# Altium project Assignment2.PrjPcb (part 2 of 2)

## Sheet IMU_LSM6DSOTR.SchDoc: IMU LSM6DSOTR
size 431 x 279 mm; Date: 02/15/2021; DrawnBy: Team KOIN; Organization: University of Pennsylvania; DocumentNumber: 8; Revision: 2; SheetNumber: 3; SheetTotal: 8
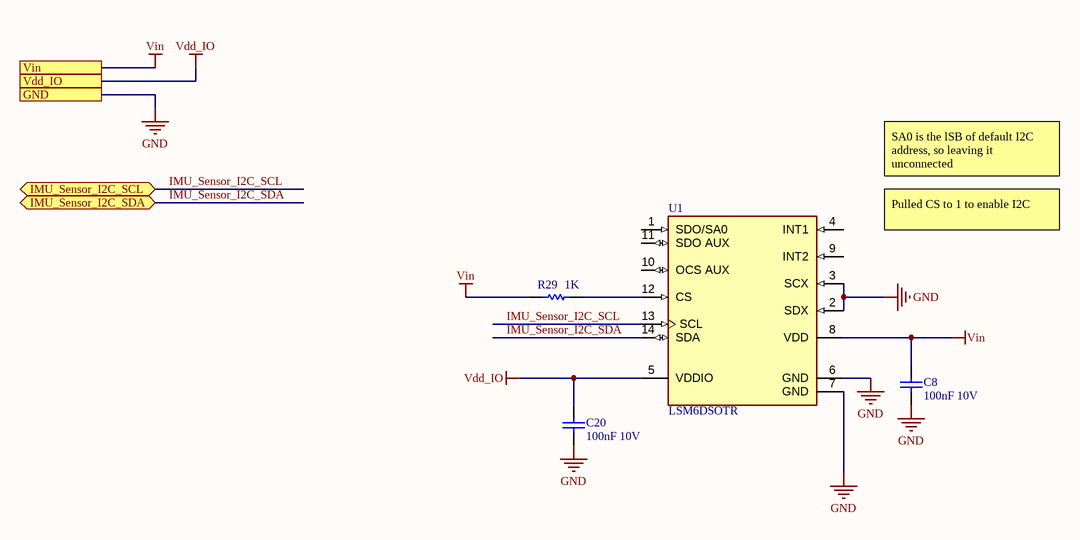
[diagram p6: IMU_LSM6DSOTR.SchDoc]

### Parts
C8  100nF 10V  [CAPC0402(1005)60_L]
C20  100nF 10V  [CAPC0402(1005)60_L]
R29  1K  [RESC0603(1608)_M]
U1  LSM6DSOTR  [FP-LGA-14L-DM00249496-MFG]

### Ports
GND, IMU_Sensor_I2C_SCL (bidir), IMU_Sensor_I2C_SDA (bidir), Vdd_IO, Vin

### Nets
GND: C8.2 C20.2 U1.2(SDX) U1.3(SCX) U1.6(GND) U1.7(GND) ; port GND
Vdd_IO: C8.1 C20.1 R29.1 U1.5(VDDIO) U1.8(VDD) ; port Vin, port Vdd_IO  [also labelled Vin]  [project net 3V3]
IMU_Sensor_I2C_SCL: U1.13(SCL) ; port IMU_Sensor_I2C_SCL  [project net IMU_I2C_SCL]
IMU_Sensor_I2C_SDA: U1.14(SDA) ; port IMU_Sensor_I2C_SDA  [project net IMU_I2C_SDA]
NetR29_2: R29.2 U1.12(CS)

Not connected (* = marked no-connect by the designer): U1 1(SDO/SA0) 4(INT1) 9(INT2) 10(OCS_AUX) 11(SDO_AUX)

### Notes on the sheet
- SA0 is the lSB of default I2C address, so leaving it unconnected
- Pulled CS to 1 to enable I2C
- DWG. NO.
- REV.
- SHT.
- THIS DOCUMENT AND THE DATA DISCLOSED HEREIN OR HEREWITH IS THE PROPERTY OF ALTIUM LIMITED AND MAY BE FREELY DISTRIBUTED IN WHOLE. NO RIGHTS ARE RESERVED OR EXPRESS OR IMPLIED WARANTEE GIVEN.
- REVISION
- DESCRIPTION
- DATE
- APPROVED
- ENG:
- APPROVALS
- PROJECT
- DSN:
- CHK:
- REFERENCE DOCUMENTS
- PROJECT REVISION:
- TITLE
- DOCUMENT REVISION:
- DESIGN ITEM:
- BOM:
- FAB DWG:
- PCB DWG:
- ASSY DWG:
- SCALE:
- SIZE
- B
- CAGE CODE
- FILE NAME
- DWG NO.
- SHEET
- OF
- REV

### Library data of the parts
C8 C20 = CMP-1034-02064-1: CAP 100nF 10V ±5% 0402 (1005 Metric) Thickness 0.6mm SMD; Tolerance: Â±5%; Case-EIA: 0402; Case-Metric: 1005; Max Thickness: 0.6 mm; Value: 100nF; Rated Voltage: 10 V; Technology: SMT
R29 = CMP-1012-00510-1: 1K 0.1W 1% 0603 (1608 Metric)  SMD; Case-Metric: 1608; Case-EIA: 0603; Value: 1000.00 Ohm; Technology: SMT; Tolerance: 1 %; Power: 0.1 W
U1 = CMP-12177-000012-1: CONSUMER MEMS; Manufacturer: STMicroelectronics; Gyro Range: 125/250/500/1000/2000°/s; Max Supply Voltage: 3.6V; Sensor Output: I2C,SPI; Operating Supply Current: 0.55mA; Accel Range: 2/4/8/16g; Min Supply Voltage: 1.62V; Sensor Type: Temperature,Accelerometer,Gyroscope; Height: 0.86mm; Automotive: No; Device Class L3: Inertial Measurement Units (IMUs); Device Class L1: Sensors; ComponentLink2Description: Datasheet; Device Class L2: Motion Sensors; Temperature: -40°C to +85°C; Package: LGA-14L-DM00249496; Octopart: https://octopart.com/lsm6dsotr-stmicroelectronics-81706672; Temperature Range Low: -40°C; Digikey Description: CONSUMER MEMS; ComponentLink2URL: https://www.st.com/resource/en/datasheet/lsm6dso.pdf; Manufacturer Part Number: LSM6DSOTR; Mouser Description: iNEMO inertial module: "always-on" integrated 3D accelerometer and 3D gyroscope; Footprint Url: https://www.st.com/content/ccc/resource/technical/document/technical_note/73/17/9c/16/dd/96/4a/01/CD00134799.pdf/files/CD00134799.pdf/jcr:content/translations/en.CD00134799.pdf; Lead Free: Yes; RoHS: TRUE; Category: IC; Temperature Range High: +85°C

## Sheet Buzzer.SchDoc
size 431 x 279 mm; SheetNumber: 8; SheetTotal: 8
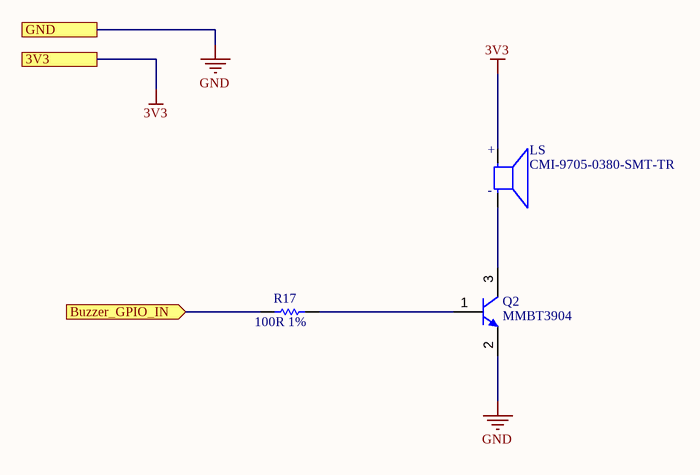
[diagram p7: Buzzer.SchDoc]

### Parts
LS  CMI-9705-0380-SMT-TR  [CUI_CMI-9705-0380-SMT-TR]
Q2  MMBT3904  [INF-SOT23_L]
R17  100R 1%  [RESC0603(1608)_N]

### Ports
3V3, Buzzer_GPIO_IN (in), GND

### Nets
3V3: LS.P ; port 3V3
GND: Q2.2(E) ; port GND
Buzzer_GPIO: R17.1 ; port Buzzer_GPIO_IN
NetLS_N: LS.N Q2.3(C)
NetQ2_1: Q2.1(B) R17.2

### Notes on the sheet
- DWG. NO.
- REV.
- SHT.
- THIS DOCUMENT AND THE DATA DISCLOSED HEREIN OR HEREWITH IS THE PROPERTY OF ALTIUM LIMITED AND MAY BE FREELY DISTRIBUTED IN WHOLE. NO RIGHTS ARE RESERVED OR EXPRESS OR IMPLIED WARANTEE GIVEN.
- REVISION
- DESCRIPTION
- DATE
- APPROVED
- ENG:
- APPROVALS
- PROJECT
- DSN:
- CHK:
- REFERENCE DOCUMENTS
- PROJECT REVISION:
- TITLE
- DOCUMENT REVISION:
- DESIGN ITEM:
- BOM:
- FAB DWG:
- PCB DWG:
- ASSY DWG:
- SCALE:
- SIZE
- B
- CAGE CODE
- FILE NAME
- DWG NO.
- SHEET
- OF
- REV
- (in symbol CMI-9705-0380-SMT-TR) +; -

### Library data of the parts
LS = CMI-9705-0380-SMT-TR: 9.7 mm, 3 Vdc, 80 dB, Surface Mount, Driving Circuit, Magnetic Audio Indicator Buzzer; MF: CUI Devices; Value: *; CUI_purchase_URL: https://www.cuidevices.com/product/audio/buzzers/audio-indicators/cmi-9705-0380-smt-tr?utm_source=snapeda.com&utm_medium=referral&utm_campaign=snapedaBOM; Price: None; Package: CUI Inc.; SnapEDA_Link: https://www.snapeda.com/parts/CMI-9705-0380-SMT-TR/CUI%20Devices/view-part/3662541/?ref=snap; Availability: Unavailable; MP: CMI-9705-0380-SMT-TR
Q2 = CMP-1178-00008-1: NPN Silicon Switching Transistor, 40 V VCEO, 200 mA IC, SOT23, Reel, Green; Manufacturer: Infineon; IC (max): 200 mA; VCBO (max): 60 V; VCE (max): 1 V; Green: TRUE; ICBO (max): 50 nA; IC: 10 mA; VCEO (max): 40 V; VEBO (max): 6 V; ComponentLink3Description: Package Specification; ComponentLink2Description: Datasheet; PackageDescription: 3-Pin Small Outline Transistor Package, 1.3 x 2.9 mm Body, 0.95 mm Pitch; Packing: Reel; ComponentLink1Description: Manufacturer URL; Polarity: NPN; ComponentLink3URL: http://www.infineon.com/dgdl/SOT23-Package_Overview.pdf?folderId=db3a30431936bc4b0119532290053c66&fileId=db3a30431936bc4b0119533468123c85; PackageReference: SOT23; Mounting Technology: Surface Mount; VCE: 1 V; ComponentLink2URL: http://www.infineon.com/dgdl/smbt3904series_mmbt3904.pdf?folderId=db3a30431441fb5d011445fab851018e&fileId=db3a30431441fb5d0114460005c10191; PartNumber: MMBT3904; PackageVersion: Apr-08; ComponentLink1URL: http://www.infineon.com/
R17 = CMP-1012-00397-1: 100R 0.1W 1% 0603 (1608 Metric)  SMD; Value: 100.00 Ohm; Case-EIA: 0603; Case-Metric: 1608; Technology: SMT; Tolerance: 1 %; Power: 0.1 W

## Nets that join several sheets
3V3: MAIN (7 pins), Memory (5 pins), IMU_LSM6DSOTR (5 pins), Buzzer (LS.P)
12V: MAIN (R2.2 TP5.1), relay_solenoid (P3.2)
GND: MAIN (11 pins), MCU (19 pins), Memory (5 pins), 3V3_BUCK (8 pins), 12V6_Boost (17 pins), relay_solenoid (5V_relay.11 Q1.1 R24.1), IMU_LSM6DSOTR (6 pins), Buzzer (Q2.2)
VBAT: MAIN (P1.3 TP18.1), 3V3_BUCK (6 pins), 12V6_Boost (6 pins), relay_solenoid (5V_relay.A1 D1.1 D2.1)
Battery_Status_LED: MAIN (R8.1), MCU (U4.36)
Buzzer_GPIO: MAIN (TP19.1), MCU (U4.22), Buzzer (R17.1)
Camera_SERCOM3_UART_RX: MAIN (P2.3), MCU (U4.14)
Camera_SERCOM3_UART_TX: MAIN (P2.4), MCU (U4.15)
Device_Status_LED: MAIN (R7.1), MCU (U4.27)
Extra_Button_GPIO: MAIN (C24.2 R28.2 TP22.1), MCU (U4.9)
FLASH_MEM_SPI_SS: MCU (U4.37), Memory (R13.1 SD1.2 TP11.1)
IMU_I2C_SCL: MAIN (P5.3 R15.1 TP20.1), MCU (U4.38), IMU_LSM6DSOTR (U1.13)
IMU_I2C_SDA: MAIN (P5.4 R10.1 TP21.1), MCU (U4.39), IMU_LSM6DSOTR (U1.14)
MCU_LED: MAIN (DS1.2), MCU (U4.16)
MCU_RX_UART_CLI: MAIN (P11.2), MCU (U4.44)
MCU_TX_UART_CLI: MAIN (P11.3), MCU (U4.43)
MEM_SPI_CLK: MAIN (R6.2), Memory (SD1.5 TP10.1)
MEM_SPI_MISO: MAIN (R5.2), Memory (SD1.7 TP9.1)
MEM_SPI_MOSI: MAIN (R4.2), Memory (SD1.3 TP8.1)
SERCOM1_PAD2_SPI_MISO: MAIN (R5.1), MCU (U4.8)
SERCOM1_PAD2_SPI_MOSI: MAIN (R4.1), MCU (U4.11)
SERCOM1_PAD3_SPI_SCK: MAIN (R6.1), MCU (U4.12)
Solenoid_GPIO: MCU (U4.31), relay_solenoid (R23.1)
VOUT: MAIN (R2.1), 12V6_Boost (6 pins)
VOUT_TPS62: MAIN (R1.1), 3V3_BUCK (5 pins)
Wifi_Status_LED: MAIN (R9.2), MCU (U4.33)